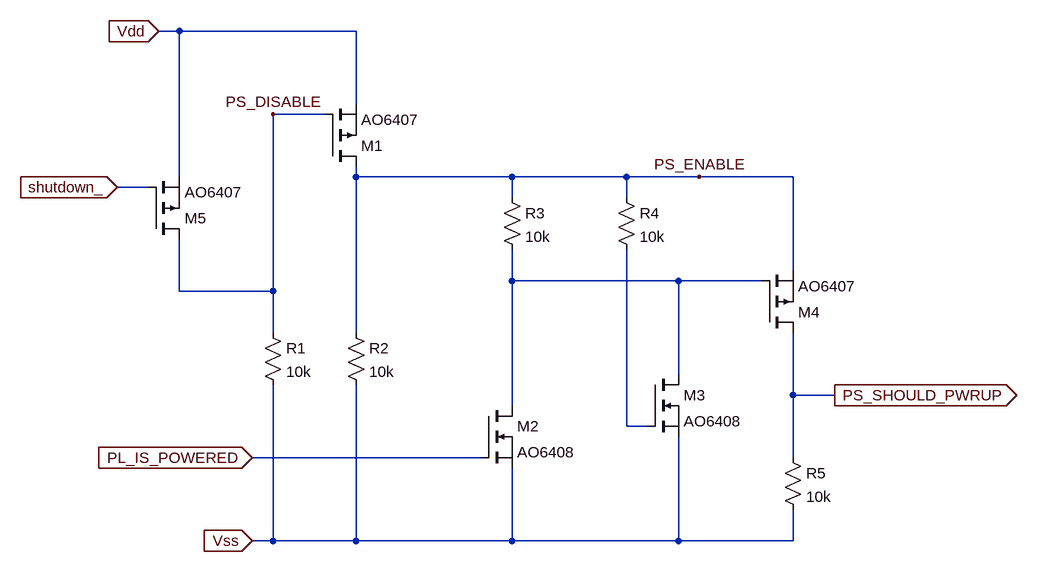
[diagram p0: schematic PS.power-up-logic.asc]
PS.power-up-logic.asc, the LTspice schematic file:
Version 4
SHEET 1 920 680
WIRE -432 -560 -464 -560
WIRE -160 -560 -432 -560
WIRE -160 -448 -160 -560
WIRE -208 -432 -288 -432
WIRE -432 -336 -432 -560
WIRE -160 -336 -160 -352
WIRE 80 -336 -160 -336
WIRE 256 -336 80 -336
WIRE 368 -336 256 -336
WIRE 512 -336 368 -336
WIRE -480 -320 -528 -320
WIRE 80 -304 80 -336
WIRE 256 -304 256 -336
WIRE 512 -192 512 -336
WIRE 80 -176 80 -224
WIRE 336 -176 80 -176
WIRE 464 -176 336 -176
WIRE -432 -160 -432 -240
WIRE -288 -160 -288 -432
WIRE -288 -160 -432 -160
WIRE -288 -96 -288 -160
WIRE -160 -96 -160 -336
WIRE 336 -32 336 -176
WIRE 512 0 512 -96
WIRE 576 0 512 0
WIRE 80 16 80 -176
WIRE 256 48 256 -224
WIRE 288 48 256 48
WIRE 32 96 -320 96
WIRE 512 96 512 0
WIRE -288 224 -288 -16
WIRE -288 224 -320 224
WIRE -160 224 -160 -16
WIRE -160 224 -288 224
WIRE 80 224 80 112
WIRE 80 224 -160 224
WIRE 336 224 336 64
WIRE 336 224 80 224
WIRE 512 224 512 176
WIRE 512 224 336 224
FLAG 576 0 PS_SHOULD_PWRUP
IOPIN 576 0 Out
FLAG 368 -336 PS_ENABLE
FLAG -288 -432 PS_DISABLE
FLAG -320 224 Vss
IOPIN -320 224 In
FLAG -464 -560 Vdd
IOPIN -464 -560 In
FLAG -320 96 PL_IS_POWERED
IOPIN -320 96 In
FLAG -528 -320 shutdown_
IOPIN -528 -320 In
SYMBOL pmos -208 -352 M180
SYMATTR InstName M1
SYMATTR Value AO6407
SYMBOL nmos 32 16 R0
SYMATTR InstName M2
SYMATTR Value AO6408
SYMBOL res -304 -112 R0
SYMATTR InstName R1
SYMATTR Value 10k
SYMBOL res -176 -112 R0
SYMATTR InstName R2
SYMATTR Value 10k
SYMBOL res 64 -320 R0
SYMATTR InstName R3
SYMATTR Value 10k
SYMBOL res 240 -320 R0
SYMATTR InstName R4
SYMATTR Value 10k
SYMBOL res 496 80 R0
SYMATTR InstName R5
SYMATTR Value 10k
SYMBOL nmos 288 -32 R0
SYMATTR InstName M3
SYMATTR Value AO6408
SYMBOL pmos 464 -96 M180
SYMATTR InstName M4
SYMATTR Value AO6407
SYMBOL pmos -480 -240 M180
SYMATTR InstName M5
SYMATTR Value AO6407

The netlist it stands for:
* PS.power-up-logic.asc
M1 PS_ENABLE PS_DISABLE Vdd Vdd AO6407
M2 N001 PL_IS_POWERED Vss Vss AO6408
R1 PS_DISABLE Vss 10k
R2 PS_ENABLE Vss 10k
R3 PS_ENABLE N001 10k
R4 PS_ENABLE N002 10k
R5 PS_SHOULD_PWRUP Vss 10k
M3 N001 N002 Vss Vss AO6408
M4 PS_SHOULD_PWRUP N001 PS_ENABLE PS_ENABLE AO6407
M5 PS_DISABLE shutdown_ Vdd Vdd AO6407
.model NMOS NMOS
.model PMOS PMOS
.lib standard.mos
.backanno
.end